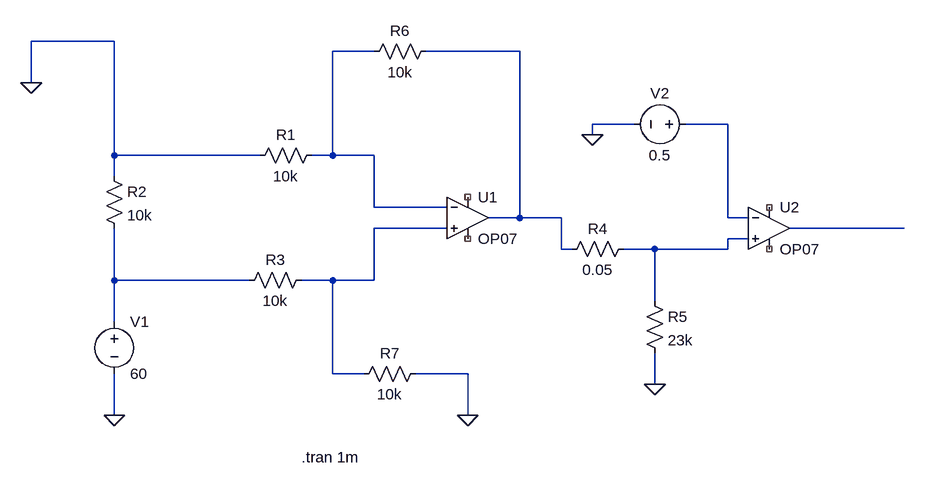
[diagram p0: schematic Draft1.asc]
Draft1.asc, the LTspice schematic file:
Version 4
SHEET 1 1556 832
WIRE 336 176 208 176
WIRE 736 192 672 192
WIRE 960 192 816 192
WIRE 208 240 208 176
WIRE 1136 304 1072 304
WIRE 1280 304 1216 304
WIRE 1072 320 1072 304
WIRE 336 352 336 176
WIRE 560 352 336 352
WIRE 672 352 672 192
WIRE 672 352 640 352
WIRE 736 352 672 352
WIRE 336 384 336 352
WIRE 736 432 736 352
WIRE 848 432 736 432
WIRE 960 448 960 192
WIRE 960 448 912 448
WIRE 1024 448 960 448
WIRE 1280 448 1280 304
WIRE 1312 448 1280 448
WIRE 848 464 736 464
WIRE 1552 464 1376 464
WIRE 1312 480 1280 480
WIRE 1024 496 1024 448
WIRE 1040 496 1024 496
WIRE 1168 496 1120 496
WIRE 1280 496 1280 480
WIRE 1280 496 1168 496
WIRE 336 544 336 464
WIRE 544 544 336 544
WIRE 672 544 624 544
WIRE 736 544 736 464
WIRE 736 544 672 544
WIRE 1168 576 1168 496
WIRE 336 608 336 544
WIRE 672 688 672 544
WIRE 720 688 672 688
WIRE 880 688 800 688
WIRE 1168 704 1168 656
WIRE 336 752 336 688
WIRE 880 752 880 688
FLAG 208 240 0
FLAG 336 752 0
FLAG 1072 320 0
FLAG 1168 704 0
FLAG 880 752 0
SYMBOL res 320 368 R0
SYMATTR InstName R2
SYMATTR Value 10k
SYMBOL OpAmps/OP07 880 384 R0
SYMATTR InstName U1
SYMBOL Res 656 336 R90
WINDOW 0 0 56 VBottom 2
WINDOW 3 32 56 VTop 2
SYMATTR InstName R1
SYMATTR Value 10k
SYMBOL Res 640 528 R90
WINDOW 0 0 56 VBottom 2
WINDOW 3 32 56 VTop 2
SYMATTR InstName R3
SYMATTR Value 10k
SYMBOL voltage 336 592 R0
SYMATTR InstName V1
SYMATTR Value 60
SYMBOL OpAmps/OP07 1344 400 R0
SYMATTR InstName U2
SYMBOL voltage 1232 304 R90
WINDOW 0 -32 56 VBottom 2
WINDOW 3 32 56 VTop 2
SYMATTR InstName V2
SYMATTR Value 0.5
SYMBOL Res 1136 480 R90
WINDOW 0 0 56 VBottom 2
WINDOW 3 32 56 VTop 2
SYMATTR InstName R4
SYMATTR Value 0.05
SYMBOL Res 1152 560 R0
SYMATTR InstName R5
SYMATTR Value 23k
SYMBOL Res 832 176 R90
WINDOW 0 0 56 VBottom 2
WINDOW 3 32 56 VTop 2
SYMATTR InstName R6
SYMATTR Value 10k
SYMBOL Res 816 672 R90
WINDOW 0 0 56 VBottom 2
WINDOW 3 32 56 VTop 2
SYMATTR InstName R7
SYMATTR Value 10k
TEXT 624 816 Left 2 !.tran 1m

The netlist it stands for:
* Draft1.asc
R2 0 N007 10k
XU1 N004 N001 NC_01 NC_02 N002 LT1001  ; OP07, pins In+ In- V+ V- OUT
R1 N001 0 10k
R3 N004 N007 10k
V1 N007 0 60
XU2 N006 N003 NC_03 NC_04 N005 LT1001  ; OP07, pins In+ In- V+ V- OUT
V2 N003 0 0.5
R4 N006 N002 0.05
R5 N006 0 23k
R6 N002 N001 10k
R7 0 N004 10k
.tran 1m
.lib LTC.lib
.backanno
.end